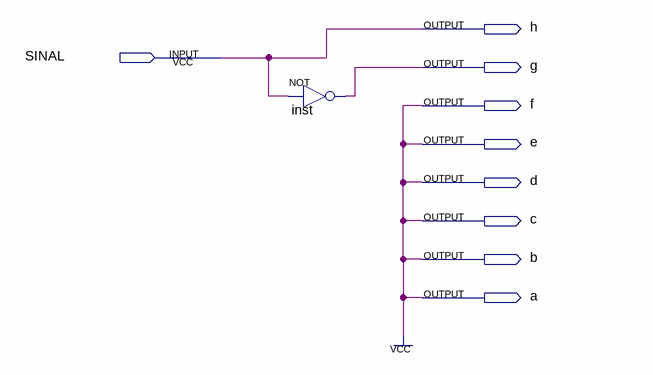
[diagram p0: schematic sheet]
// Quartus schematic 7segsinal.bdf as structural Verilog: 1 symbols, 9 pins
module \7segsinal  (
  input  SINAL,
  output h,
  output g,
  output f,
  output e,
  output d,
  output c,
  output b,
  output a
);

  not inst (g, SINAL);

  assign a = 1'b1;
  assign b = 1'b1;
  assign c = 1'b1;
  assign d = 1'b1;
  assign e = 1'b1;
  assign f = 1'b1;
  assign h = SINAL;
endmodule
